# EAGLE design klone_board1 (EAGLE 7.3.0)
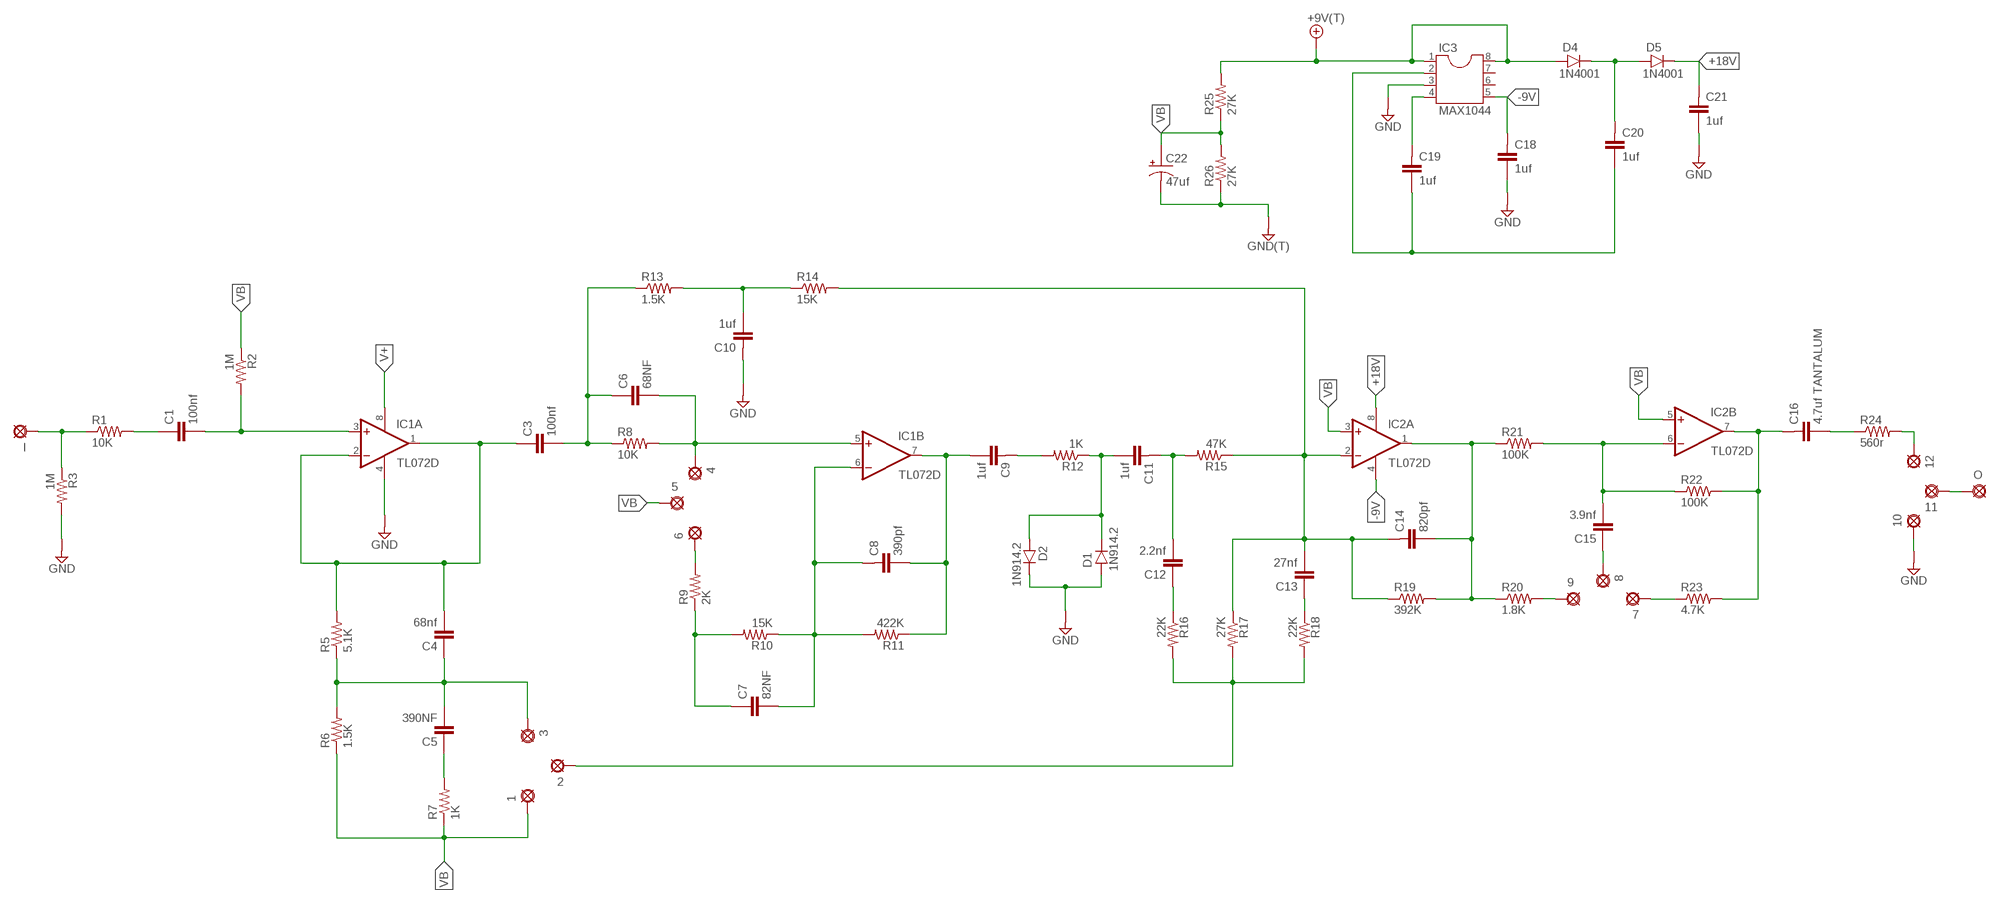
[diagram p0: schematic, sheet 1]

## Parts
1  PAD  [SQUARE]
2  PAD  [SQUARE]
3  PAD  [SQUARE]
4  PAD  [SQUARE]
5  PAD  [SQUARE]
6  PAD  [SQUARE]
7  PAD  [SQUARE]
8  PAD  [SQUARE]
9  PAD  [SQUARE]
10  PAD  [SQUARE]
11  PAD  [SQUARE]
12  PAD  [SQUARE]
C1  100nf  072X0252  [072X025]
C3  100nf  072X0252  [072X025]
C4  68nf  072X0252  [072X025]
C5  390NF  072X0252  [072X025]
C6  68NF  072X0252  [072X025]
C7  82NF  072X0252  [072X025]
C8  390pf  050X030_0251  [050X030_025]
C9  1uf  050X030_0251  [050X030_025]
C10  1uf  050X030_0251  [050X030_025]
C11  1uf  050X030_0251  [050X030_025]
C12  2.2nf  072X0252  [072X025]
C13  27nf  072X0252  [072X025]
C14  820pf  050X030_0251  [050X030_025]
C15  3.9nf  072X0252  [072X025]
C16  4.7uf TANTALUM  050X030_0251  [050X030_025]
C18  1uf  050X030_0251  [050X030_025]
C19  1uf  050X030_0251  [050X030_025]
C20  1uf  050X030_0251  [050X030_025]
C21  1uf  050X030_0251  [050X030_025]
C22  47uf  0501  [050_020_1]
D1  1N914.2  [DO35-2]
D2  1N914.2  [DO35-2]
D4  1N4001  1N400X.2  [DO41-2]
D5  1N4001  1N400X.2  [DO41-2]
G  GND(T)  [SQUARE]
I  IN  PAD  [SQUARE]
IC1  TL072D  [SO08]
IC2  TL072D  [SO08]
IC3  MAX1044  DIL8SMD  [SO08]
O  OUT  PAD  [SQUARE]
R1  10K  3MM.2  [R0204/2]
R2  1M  3MM.2  [R0204/2]
R3  1M  3MM.2  [R0204/2]
R5  5.1K  3MM.2  [R0204/2]
R6  1.5K  3MM.2  [R0204/2]
R7  1K  3MM.2  [R0204/2]
R8  10K  3MM.2  [R0204/2]
R9  2K  3MM.2  [R0204/2]
R10  15K  3MM.2  [R0204/2]
R11  422K  3MM.2  [R0204/2]
R12  1K  3MM.2  [R0204/2]
R13  1.5K  3MM.2  [R0204/2]
R14  15K  3MM.2  [R0204/2]
R15  47K  3MM.2  [R0204/2]
R16  22K  3MM.2  [R0204/2]
R17  27K  3MM.2  [R0204/2]
R18  22K  3MM.2  [R0204/2]
R19  392K  3MM.2  [R0204/2]
R20  1.8K  3MM.2  [R0204/2]
R21  100K  3MM.2  [R0204/2]
R22  100K  3MM.2  [R0204/2]
R23  4.7K  3MM.2  [R0204/2]
R24  560r  3MM.2  [R0204/2]
R25  27K  3MM.2  [R0204/2]
R26  27K  3MM.2  [R0204/2]
V  +9V(T)  [SQUARE]

## Nets
+18V: C21.1 D5.C IC2.8(P:V+)
-9V: C18.1 IC2.4(P:V-) IC3.5
GND: 10.1(PAD) C10.1 C18.2 C21.2 C22.- D1.A D2.C G.1(GND) IC1.4(P:V-) IC3.3 R3.2 R26.1
N$1: I.1(PAD) R1.1 R3.1
N$2: C1.1 R1.2
N$3: C1.2 IC1.3(A:+IN) R2.2
N$4: C3.1 C4.2 IC1.1(A:OUT) IC1.2(A:-IN) R5.2
N$5: C3.2 C6.1 R8.1 R13.1
N$6: 4.1(PAD) C6.2 IC1.5(B:+IN) R8.2
N$7: 6.1(PAD) R9.2
N$8: C7.1 R9.1 R10.2
N$9: C7.2 C8.1 IC1.6(B:-IN) R10.1 R11.2
N$10: C8.2 C9.2 IC1.7(B:OUT) R11.1
N$11: C10.2 R13.2 R14.1
N$12: 3.1(PAD) C4.1 C5.2 R5.1 R6.2
N$13: C11.1 C12.2 R15.2
N$14: C11.2 D1.C D2.A R12.1
N$15: C9.1 R12.2
N$16: C5.1 R7.2
N$17: C12.1 R16.1
N$18: 9.1(PAD) R20.2
N$19: 2.1(PAD) R16.2 R17.2 R18.2
N$20: 7.1(PAD) R23.1
N$21: C13.1 R18.1
N$22: C14.2 IC2.1(A:OUT) R19.2 R20.1 R21.1
N$23: C13.2 C14.1 IC2.2(A:-IN) R14.2 R15.1 R17.1 R19.1
N$24: C15.2 IC2.6(B:-IN) R21.2 R22.1
N$25: 8.1(PAD) C15.1
N$26: C16.1 IC2.7(B:OUT) R22.2 R23.2
N$27: C16.2 R24.1
N$28: 12.1(PAD) R24.2
N$29: 11.1(PAD) O.1(PAD)
N$31: C20.1 D4.C D5.A
N$32: C19.2 C20.2 IC3.2
N$33: C19.1 IC3.4
V+: D4.A IC1.8(P:V+) IC3.1 IC3.8 R25.2 V.1(+9V)
VB: 1.1(PAD) 5.1(PAD) C22.+ IC2.3(A:+IN) IC2.5(B:+IN) R2.1 R6.1 R7.1 R25.1 R26.2
Unconnected: IC3.6 IC3.7

## Library data of the parts
1-12 I O = kdd-supply:PAD: PAD use this package for pads with any purpose, including input, output, send or return various pad shapes: round, square, octogonal, long, and long offset
C1 C3-C7 C12 C13 C15 = kdd-caps-film-box:072X025: 1000pF - 0.47uF WIMA MKP2 63, 100V: 1000pF - 0.015uF; MKS2 50V: 0.33 - 0.47uF; 63V: 1000pF - 0.22uF;
C8-C11 C14 C16 C18-C21 = kdd-caps-ceramic:050X030_025: 47 - 120pF Xicon Ceramic Disc 2.5mm lead spacing
C22 = kdd-caps-electro-pol:050: 0.22 - 100uF Xicon values at Mouser.com: 10V: 10 - 100uF; 16V: 2.2 - 47uF; 25V: 0.47 - 47uF; 50V: 0.22 - 22uF
D1 D2 = kdd-diodes:1N914: Fast Switching Diode DO-35 glass case a.k.a. 1N4148
D4 D5 = kdd-diodes:1N400X: Rectifier Diodes often used in power supply to prevent damage from reverse polarization
G = kdd-supply:GND(T): Ground use this to hook up ground (GND) throughout a schematic instead of running wire automatically labels the net "GND" adds a hookup pad to the circuit board (you can use several)
IC1 IC2 = kdd-ics:TL072: OP AMP
IC3 = kdd-ics:DIL8: Dual In Line
R1-R3 R5-R26 = kdd-resistors:3MM: 3mm Resistors Leads spaced 1-6 holes apart for 0.1" perfboard. Suitable for 1/8 watt resistors.
V = kdd-supply:+9V(T): +9V Voltage Supply use this to hook up +9v throughout a schematic instead of running wire automatically labels the net "+9v" adds a hookup pad to the circuit board

## Board
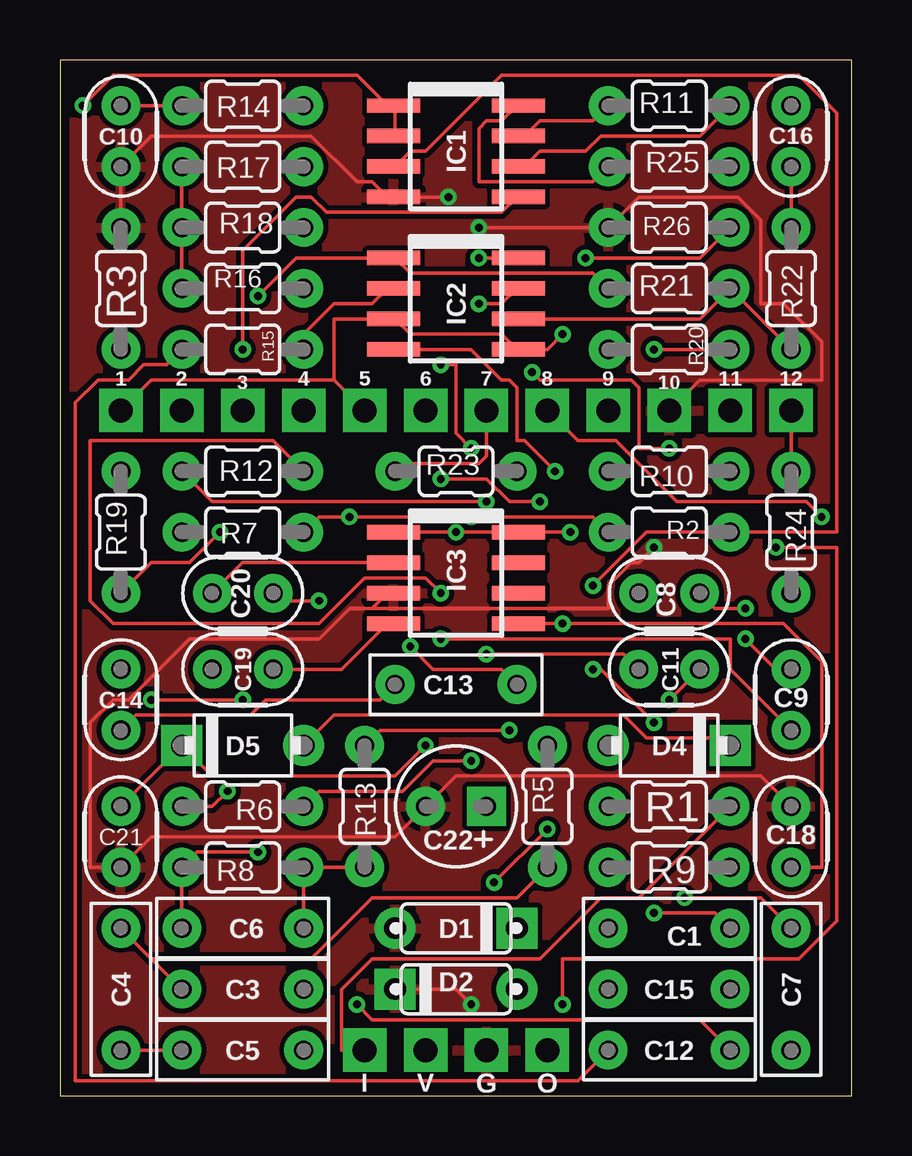
[diagram p1: board, top side]
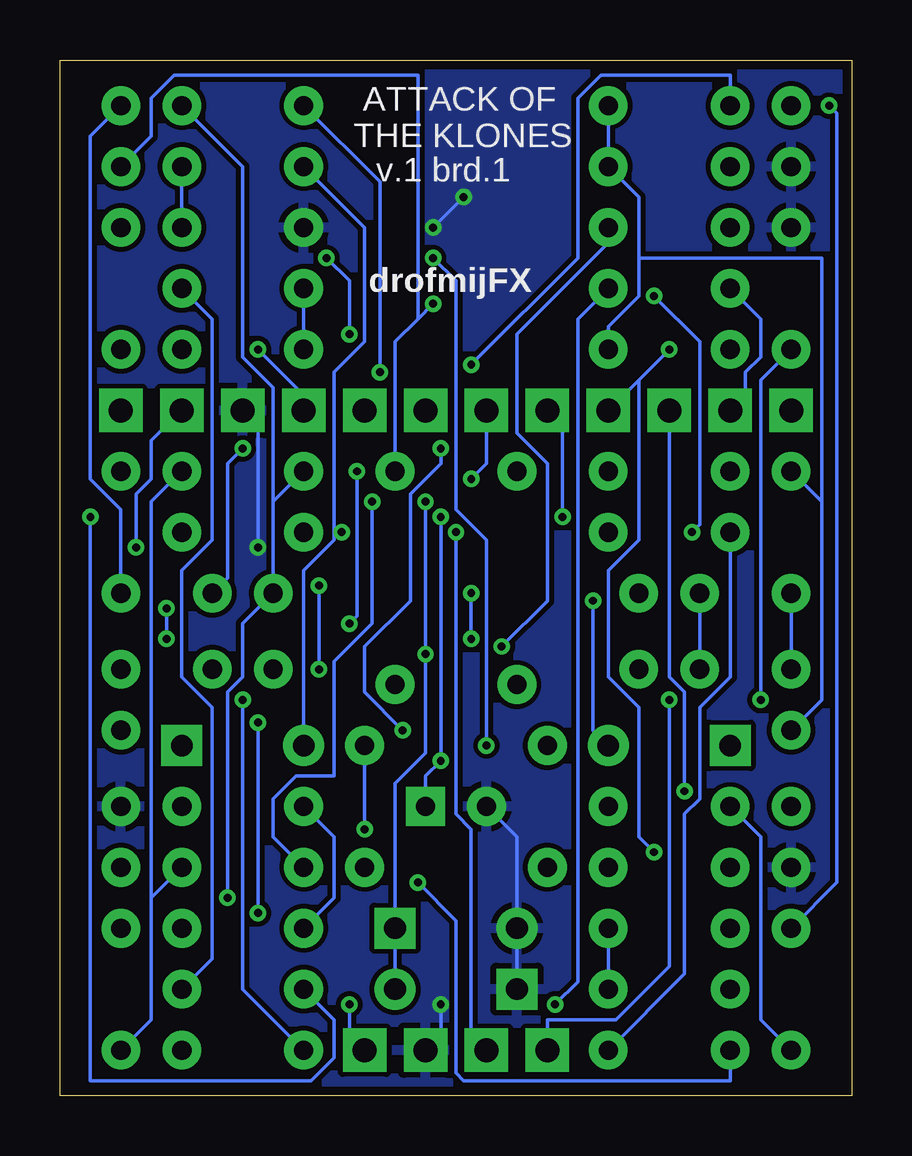
[diagram p2: board, bottom side, seen from below]

Size 33.02 x 43.18 mm. Coordinates in mm from the lower left corner, seen from the top.
Outline: 0,0 33.02,0 33.02,43.18 0,43.18 0,0
Copper layers (1*16): Top 0.0356mm / dielectric 1.5011mm / Bottom 0.0356mm
Design rules "Kyle-OSH": minimum track width 6mil, minimum drill 13mil, track to track 8mil, track to pad 8mil, pad to pad 8mil, via to via 8mil, smd to smd 6mil, copper to edge 15mil, drill to drill 6mil, minimum pad ring 16mil, minimum via ring 7mil, stop-mask expansion 3mil, vias tented up to drill 25mil, thermal gap 10mil

### Footprints (pad centres in the part's own frame; a part is rotated, then mirrored left to right if it is on the bottom)
SQUARE = drill 1 square: 1 0,0
072X025 = drill 0.8: 1 -2.54,0; 2 2.54,0
050X030_025 = drill 0.8: 1 -1.27,0; 2 1.27,0
050_020_1 = drill 0.8 square: + -1.27,0 | drill 0.8: - 1.27,0
DO35-2 = drill 0.9: A 2.54,0 | drill 0.9 square: C -2.54,0
DO41-2 = drill 0.9: A 2.54,0 | drill 0.9 square: C -2.54,0
SO08 = smd 0.6 x 2.2: 1 -1.905,-2.6; 2 -0.635,-2.6; 3 0.635,-2.6; 4 1.905,-2.6; 5 1.905,2.6; 6 0.635,2.6; 7 -0.635,2.6; 8 -1.905,2.6
R0204/2 = drill 0.8: 1 -2.54,0; 2 2.54,0

### Placement (x,y rotation side)
1  2.54,28.57 0 top
2  5.08,28.57 0 top
3  7.62,28.57 0 top
4  10.16,28.57 0 top
5  12.7,28.57 0 top
6  15.24,28.57 0 top
7  17.78,28.57 0 top
8  20.32,28.57 0 top
9  22.86,28.57 0 top
10  25.4,28.57 0 top
11  27.94,28.57 0 top
12  30.48,28.57 0 top
C1  25.4,6.99 0 top
C3  7.62,4.45 0 top
C4  2.54,4.45 90 top
C5  7.62,1.91 180 top
C6  7.62,6.99 180 top
C7  30.48,4.45 90 top
C8  25.4,20.95 0 top
C9  30.48,16.51 90 top
C10  2.54,40.01 90 top
C11  25.4,17.78 180 top
C12  25.4,1.91 180 top
C13  16.51,17.14 180 top
C14  2.54,16.51 90 top
C15  25.4,4.45 0 top
C16  30.48,40.01 90 top
C18  30.48,10.79 90 top
C19  7.62,17.78 180 top
C20  7.62,20.95 180 top
C21  2.54,10.79 270 top
C22  16.51,12.06 180 top
D1  16.51,6.99 180 top
D2  16.51,4.45 0 top
D4  25.4,14.61 180 top
D5  7.62,14.61 0 top
G  17.78,1.91 0 top
I  12.7,1.91 0 top
IC1  16.51,39.37 270 top
IC2  16.51,33.02 270 top
IC3  16.51,21.59 270 top
O  20.32,1.91 0 top
R1  25.4,12.06 180 top
R2  25.4,23.49 0 top
R3  2.54,33.66 90 top
R5  20.32,12.06 270 top
R6  7.62,12.06 180 top
R7  7.62,23.49 180 top
R8  7.62,9.53 180 top
R9  25.4,9.53 180 top
R10  25.4,26.04 0 top
R11  25.4,41.27 0 top
R12  7.62,26.04 0 top
R13  12.7,12.06 90 top
R14  7.62,41.27 0 top
R15  7.62,31.11 180 top
R16  7.62,33.66 180 top
R17  7.62,38.73 180 top
R18  7.62,36.2 180 top
R19  2.54,23.49 270 top
R20  25.4,31.11 0 top
R21  25.4,33.66 0 top
R22  30.48,33.66 90 top
R23  16.51,26.04 0 top
R24  30.48,23.49 90 top
R25  25.4,38.73 180 top
R26  25.4,36.2 0 top
V  15.24,1.91 0 top

### Tracks (layer width: path | path; a pad name or v marks a point on that pad's centre or on a via)
+18V  (via drill 0.33)
  Top 0.152: v17.46,34.93 IC2.8 | v15.24,14.61 13.97,13.34 6.35,13.34 D5.C C21.1
  Bottom 0.152: v17.46,34.93 16.51,33.97 16.51,24.45 15.24,23.18 v15.24,14.61
-9V  (via drill 0.33)
  Top 0.152: IC3.5 v20.95,19.68 30.16,19.68 31.75,18.1 31.75,9.53 C18.1 | IC2.4 17.14,31.11 18.41,29.84 18.73,29.84 19.05,29.53 19.05,27.3 19.37,27.3 v20.64,26.04
  Bottom 0.152: v20.64,26.04 20.64,20 v20.95,19.68
GND  (via drill 0.33)
  Top 0.152: R3.2 C10.1 3.81,40.01 10.48,40.01 12.38,38.1 13.02,38.1 13.65,37.47 IC1.4 v16.19,37.47 | 10.1 26.67,29.84 31.75,29.84 31.75,31.43 30.16,33.02 29.21,33.02 29.21,36.51 28.26,37.47 24.13,37.47 R26.1 v17.46,36.2 | 13.02,20.32 13.65,20.95 IC3.3 | 13.02,20.32 12.06,20.32 10.79,19.05 5.4,19.05 2.86,16.51 2.22,16.51 1.27,15.56 1.27,9.53 C21.2 3.81,10.79 13.97,10.79 C22.- 16.51,13.34 29.21,13.34 C18.2 | v17.14,3.81 16.51,4.45 D2.C | v24.77,22.86 24.13,22.22 23.81,22.22 22.86,21.27 22.86,20.32 13.02,20.32
  Bottom 0.152: v17.46,36.2 v16.19,37.47 | C22.- 13.97,10.79 D1.A D2.C | G.1 17.14,2.54 v17.14,3.81 | 10.1 24.77,27.94 v24.77,22.86
  pour Top: -2.54,45.09 35.56,45.09 35.56,-1.91 -2.54,-1.91
  pour Bottom: -1.27,43.82 34.29,43.82 34.29,-0.64 -1.27,-0.64
N$1  (via drill 0.33)
  Top 0.152: v7.62,16.51 v3.81,16.51 | R1.1 24.13,8.26 22.54,8.26 20,5.71 13.02,5.71 11.75,4.45 11.75,1.91 I.1
  Bottom 0.152: R3.1 3.81,29.84 v3.81,16.51 | v7.62,16.51 7.62,5.4 9.84,3.17 12.7,3.17 I.1
N$2
  Bottom 0.152: C1.1 21.59,8.26 21.59,10.79 R1.2
N$3  (via drill 0.33)
  Top 0.152: IC1.3 13.97,38.73 14.61,39.37 15.24,39.37 18.41,42.55 30.8,42.55 32.38,40.96 32.38,23.49 R2.2 24.45,23.49 v22.23,21.27 | C1.2 27.3,7.62 v24.77,7.62 | v24.77,15.56 22.54,17.78 v22.23,17.78
  Bottom 0.152: v24.77,15.56 v24.77,7.62 | v22.23,21.27 v22.23,17.78
N$4  (via drill 0.33)
  Top 0.152: IC1.2 13.97,40.01 13.97,41.27 IC1.1 13.65,41.27 12.38,42.55 2.22,42.55 v0.95,41.27 | C4.2 3.81,5.71 | 3.81,5.71 C3.1 | R5.2 19.05,8.26 13.02,8.26 10.48,5.71 3.81,5.71
  Bottom 0.152: v0.95,41.27 0.64,40.96 0.64,8.89 C4.2
N$5
  Top 0.152: R13.1 R8.1 C6.1
  Bottom 0.152: C6.1 C3.2
N$6  (via drill 0.33)
  Top 0.152: C6.2 R8.2 5.71,10.16 v8.26,10.16 | v7.62,31.11 7.62,35.24 9.84,37.47 10.48,37.47 11.11,36.83 18.41,36.83 19.05,37.47 IC1.5
  Bottom 0.152: 4.1 8.89,29.84 | 8.89,29.84 v7.62,31.11 | v8.26,10.16 8.89,10.79 8.89,16.19 10.16,17.46 10.16,21.91 8.89,23.18 8.89,29.84
N$7  (via drill 0.33)
  Top 0.152: v20,24.76 18.73,24.76 17.78,25.72 v15.88,25.72
  Bottom 0.152: R9.2 24.13,10.79 24.13,12.38 23.18,13.34 21.59,13.34 21.59,18.1 20,19.68 v20,24.76 | v15.88,25.72 15.24,26.35 6.1
N$8
  Bottom 0.152: 29.21,8.26 R9.1 | 29.21,8.26 29.21,3.17 C7.1 | R10.2 29.21,24.76 29.21,8.26
N$9  (via drill 0.33)
  Top 0.152: R11.2 26.67,40.01 22.54,40.01 21.91,39.37 20,39.37 19.37,38.73 IC1.6 | C7.2 29.21,8.26 v26.04,8.26
  Bottom 0.152: v26.04,8.26 26.04,16.83 25.4,17.46 25.4,19.68 C8.1 24.13,24.76 | 24.13,24.76 R10.1 | R11.2 25.4,38.73 25.4,30.8 24.13,29.53 24.13,24.76
N$10  (via drill 0.33)
  Top 0.152: R11.1 22.23,40.64 20,40.64 19.37,40.01 IC1.7 | C8.2 27.3,20.32 v28.57,20.32 | v28.57,19.05 29.84,17.78 C9.2 | v19.68,30.16 20,29.84 23.81,29.84 24.13,29.53 24.13,26.99 v25.4,26.99
  Bottom 0.152: v28.57,19.05 v28.57,20.32 | R11.1 19.68,38.1 v19.68,30.16 | v25.4,26.99 26.04,26.35 26.04,21.59 C8.2
N$11  (via drill 0.33)
  Top 0.152: R14.1 C10.2 | R13.2 13.34,15.24 v18.73,15.24 | v17.14,26.99 16.51,27.62 16.51,30.48 v15.88,30.48
  Bottom 0.152: v18.73,15.24 20.32,16.83 20.32,18.73 18.41,20.64 18.41,25.08 17.14,26.35 v17.14,26.99 | v15.88,30.48 11.43,34.93 11.43,41.59 10.48,42.55 5.08,42.55 R14.1
N$12  (via drill 0.33)
  Top 0.152: C5.2 C4.1 | v18.1,8.89 v20.32,11.11 | v6.99,12.7 6.35,12.06 R6.2
  Bottom 0.152: R6.2 3.81,10.79 3.81,3.17 C4.1 | v20.32,11.11 R5.1 | v18.1,8.89 16.51,7.3 16.51,0.95 16.19,0.64 5.08,0.64 C5.2 | 3.1 7.62,17.46 6.99,16.83 v6.99,12.7
N$13  (via drill 0.33)
  Top 0.152: C11.1 v25.4,16.51 | R15.2 4.45,30.48 3.49,30.48 2.86,29.84 1.59,29.84 0.64,28.89 0.64,0.64 21.59,0.64 C12.2
  Bottom 0.152: C12.2 25.4,4.45 v25.4,16.51
N$14  (via drill 0.33)
  Top 0.152: R12.1 6.35,24.76 v17.78,24.76 | C11.2 23.5,18.41 v17.78,18.41
  Bottom 0.152: v17.78,24.76 v17.78,18.41 17.78,14.29 19.05,13.02 D1.C D2.A
N$15  (via drill 0.33)
  Top 0.152: C9.1 27.94,17.78 27.94,19.05 v15.88,19.05 | v15.88,20.95 15.24,21.59 12.7,21.59 10.79,19.68 2.22,19.68 1.27,20.64 1.27,27.3 8.89,27.3 R12.2
  Bottom 0.152: v15.88,20.95 v15.88,19.05
N$16
  Bottom 0.152: C5.1 6.99,5.08 6.99,11.75 6.35,12.38 6.35,16.19 5.08,17.46 R7.2
N$17  (via drill 0.33)
  Top 0.152: C12.1 26.67,3.17 13.02,3.17 v12.38,3.81
  Bottom 0.152: v12.38,3.81 11.43,4.76 11.43,32.39 R16.1
N$18  (via drill 0.33)
  Top 0.152: v24.77,31.11 R20.2
  Bottom 0.152: v24.77,31.11 22.86,29.21 9.1
N$19
  Top 0.152: R16.2 R18.2 R17.2
  Bottom 0.152: 2.1 4.45,29.21 4.45,30.16 3.81,30.8 3.81,32.39 R16.2
N$20
  Top 0.152: R23.1 14.29,26.35 17.46,26.35 17.78,26.67 7.1
N$21  (via drill 0.33)
  Top 0.152: C13.1 18.41,17.78 15.56,17.78 v14.61,18.73
  Bottom 0.152: v14.61,18.73 12.7,20.64 12.7,26.35 13.97,27.62 13.97,31.75 10.16,35.56 R18.1
N$22  (via drill 0.33)
  Top 0.152: R21.1 22.23,34.29 14.61,34.29 13.97,34.93 IC2.1 9.84,34.93 v8.26,33.34 | R19.2 3.81,22.22 5.4,22.22 v6.67,23.49
  Bottom 0.152: R19.2 C14.2 | R21.1 R20.1 | v6.67,23.49 6.35,23.81 6.35,31.43 v8.26,33.34
N$23
  Top 0.152: R15.1 10.16,31.75 11.43,33.02 13.02,33.02 13.65,33.66 IC2.2 | C13.2 13.34,16.51 8.57,16.51 7.94,15.88 3.17,15.88 C14.1
  Bottom 0.152: R14.2 R17.1 8.89,37.47 8.89,34.93 | 8.89,34.93 8.89,33.34 10.16,32.07 R15.1 | C14.1 1.27,16.51 1.27,24.76 | R19.1 1.27,24.76 | 8.89,34.93 1.27,34.93 1.27,24.76
N$24
  Top 0.152: IC2.6 26.67,32.39 R21.2 R22.1
  Bottom 0.152: C15.2 26.67,5.71 26.67,16.19 27.94,17.46 27.94,21.91 26.67,23.18 26.67,32.39 R21.2
N$25  (via drill 0.33)
  Top 0.152: v31.75,24.13 31.11,24.76 25.72,24.76 23.18,27.3 21.59,27.3 8.1
  Bottom 0.152: C15.1 21.59,3.17 21.59,1.59 22.54,0.64 31.75,0.64 v31.75,24.13
N$26  (via drill 0.33)
  Top 0.152: C16.1 R22.2 | v17.46,33.02 18.41,33.02 19.05,33.66 IC2.7
  Bottom 0.152: 18.1,32.39 19.05,31.43 R23.2 | 18.1,32.39 v17.46,33.02 | C16.1 29.21,40.01 29.21,41.59 28.26,42.55 18.1,42.55 18.1,32.39
N$27
  Bottom 0.152: R24.1 30.48,24.45 31.75,25.72 31.75,40.01 C16.2
N$28
  Top 0.152: 12.1 R24.2
N$29  (via drill 0.33)
  Top 0.152: v20.95,3.81 20.95,5.71 30.8,5.71 32.38,7.3 32.38,22.86 v29.84,22.86
  Bottom 0.152: O.1 20.95,2.54 v20.95,3.81 | v29.84,22.86 29.84,25.08 29.21,25.72 29.21,27.3 11.1
N$31  (via drill 0.33)
  Top 0.152: C20.1 9.21,20.64 v10.79,20.64 | D4.C 27.62,14.92 24.45,14.92 23.5,15.88 11.43,15.88 D5.A
  Bottom 0.152: v10.79,20.64 10.79,15.24 D5.A
N$32
  Top 0.152: IC3.2 7.62,22.22 C20.2
  Bottom 0.152: C20.2 C19.2
N$33
  Top 0.152: C19.1 11.75,17.78 13.65,19.68 IC3.4
V+  (via drill 0.33)
  Top 0.152: IC3.1 v16.51,23.49 IC3.8 v21.27,23.49 | R25.2 22.23,38.1 17.46,38.1 17.46,40.32 17.78,40.64 18.41,40.64 19.05,41.27 IC1.8
  Bottom 0.152: V.1 15.88,2.54 15.88,11.11 16.51,11.75 v16.51,23.49 | D4.A 22.86,21.91 21.59,23.18 21.59,23.49 | 21.59,23.49 21.59,30.16 20.32,31.43 20.32,36.2 R25.2 | 21.59,23.49 v21.27,23.49
VB  (via drill 0.33)
  Top 0.152: R6.1 10.79,12.7 14.29,12.7 15.56,13.97 v17.14,13.97 | R7.1 10.79,24.13 v12.06,24.13 v17.14,24.13 22.23,24.13 R2.1 | 1.1 3.81,29.84 11.43,29.84 | 5.1 11.43,29.84 | R26.2 26.67,34.93 v21.91,34.93 | v20.95,31.75 20.32,31.11 IC2.5 19.05,31.11 18.41,31.75 14.61,31.75 13.97,32.39 IC2.3 11.43,32.39 11.43,29.84
  Bottom 0.152: C22.+ 17.78,13.34 v17.14,13.97 v17.14,24.13 | R25.1 R26.2 | v21.91,34.93 20.95,33.97 v20.95,31.75 | v12.06,24.13 12.06,27.94 5.1

### Text on the board
bNames: ATTACK OF / THE KLONES | v.1 brd.1 | drofmijFX